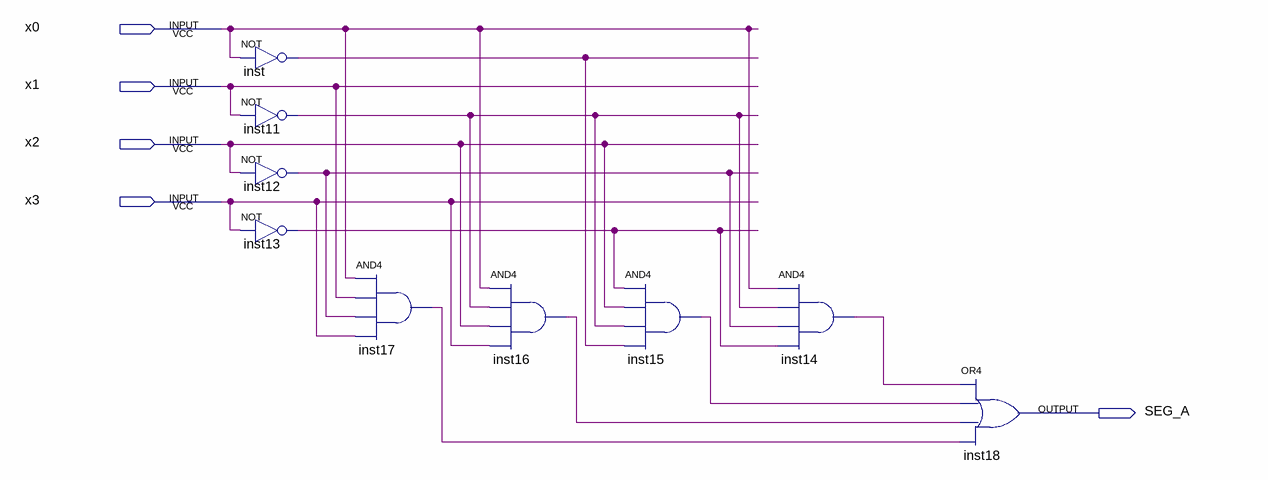
[diagram p0: schematic sheet]
// Quartus schematic SEG_A.bdf as structural Verilog: 9 symbols, 5 pins
module SEG_A (
  input  x0,
  input  x1,
  input  x2,
  input  x3,
  output SEG_A
);

  wire inst11_out, inst12_out, inst13_out, inst14_out, inst15_out, inst16_out, inst17_out, inst_out;

  not inst (inst_out, x0);
  not inst11 (inst11_out, x1);
  not inst12 (inst12_out, x2);
  not inst13 (inst13_out, x3);
  and inst17 (inst17_out, x0, x1, inst12_out, x3);
  and inst16 (inst16_out, x0, inst11_out, x2, x3);
  and inst15 (inst15_out, inst13_out, x2, inst11_out, inst_out);
  and inst14 (inst14_out, x0, inst11_out, inst12_out, inst13_out);
  or inst18 (SEG_A, inst14_out, inst15_out, inst16_out, inst17_out);
endmodule
